# EAGLE design esp32_mpboard (EAGLE 9.5.2)
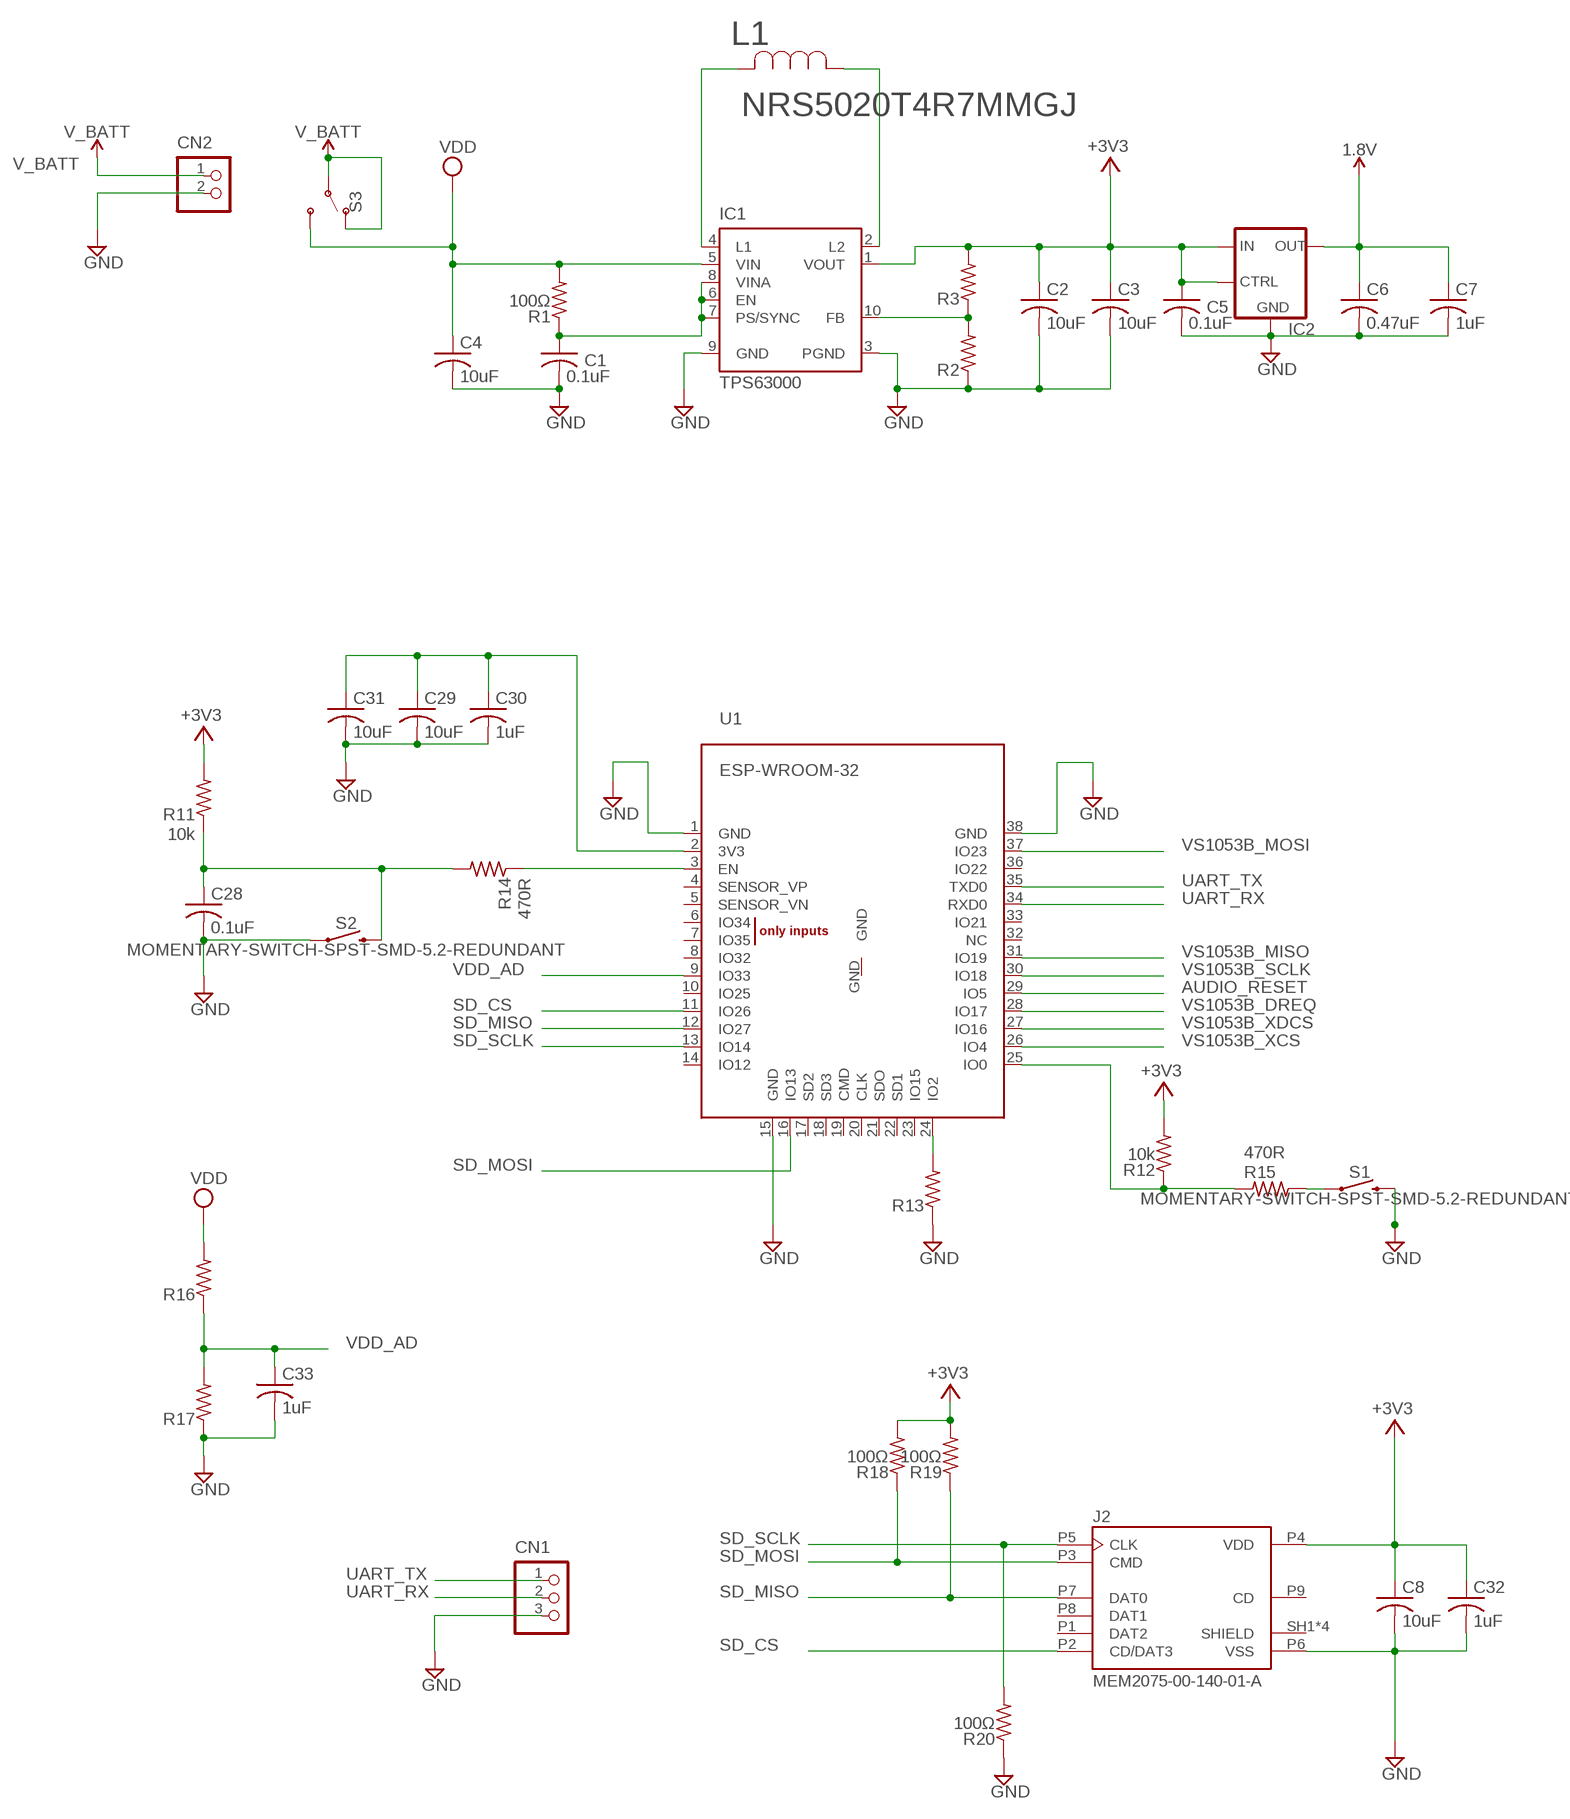
[diagram p0: schematic, sheet 1, part 1 of 2]
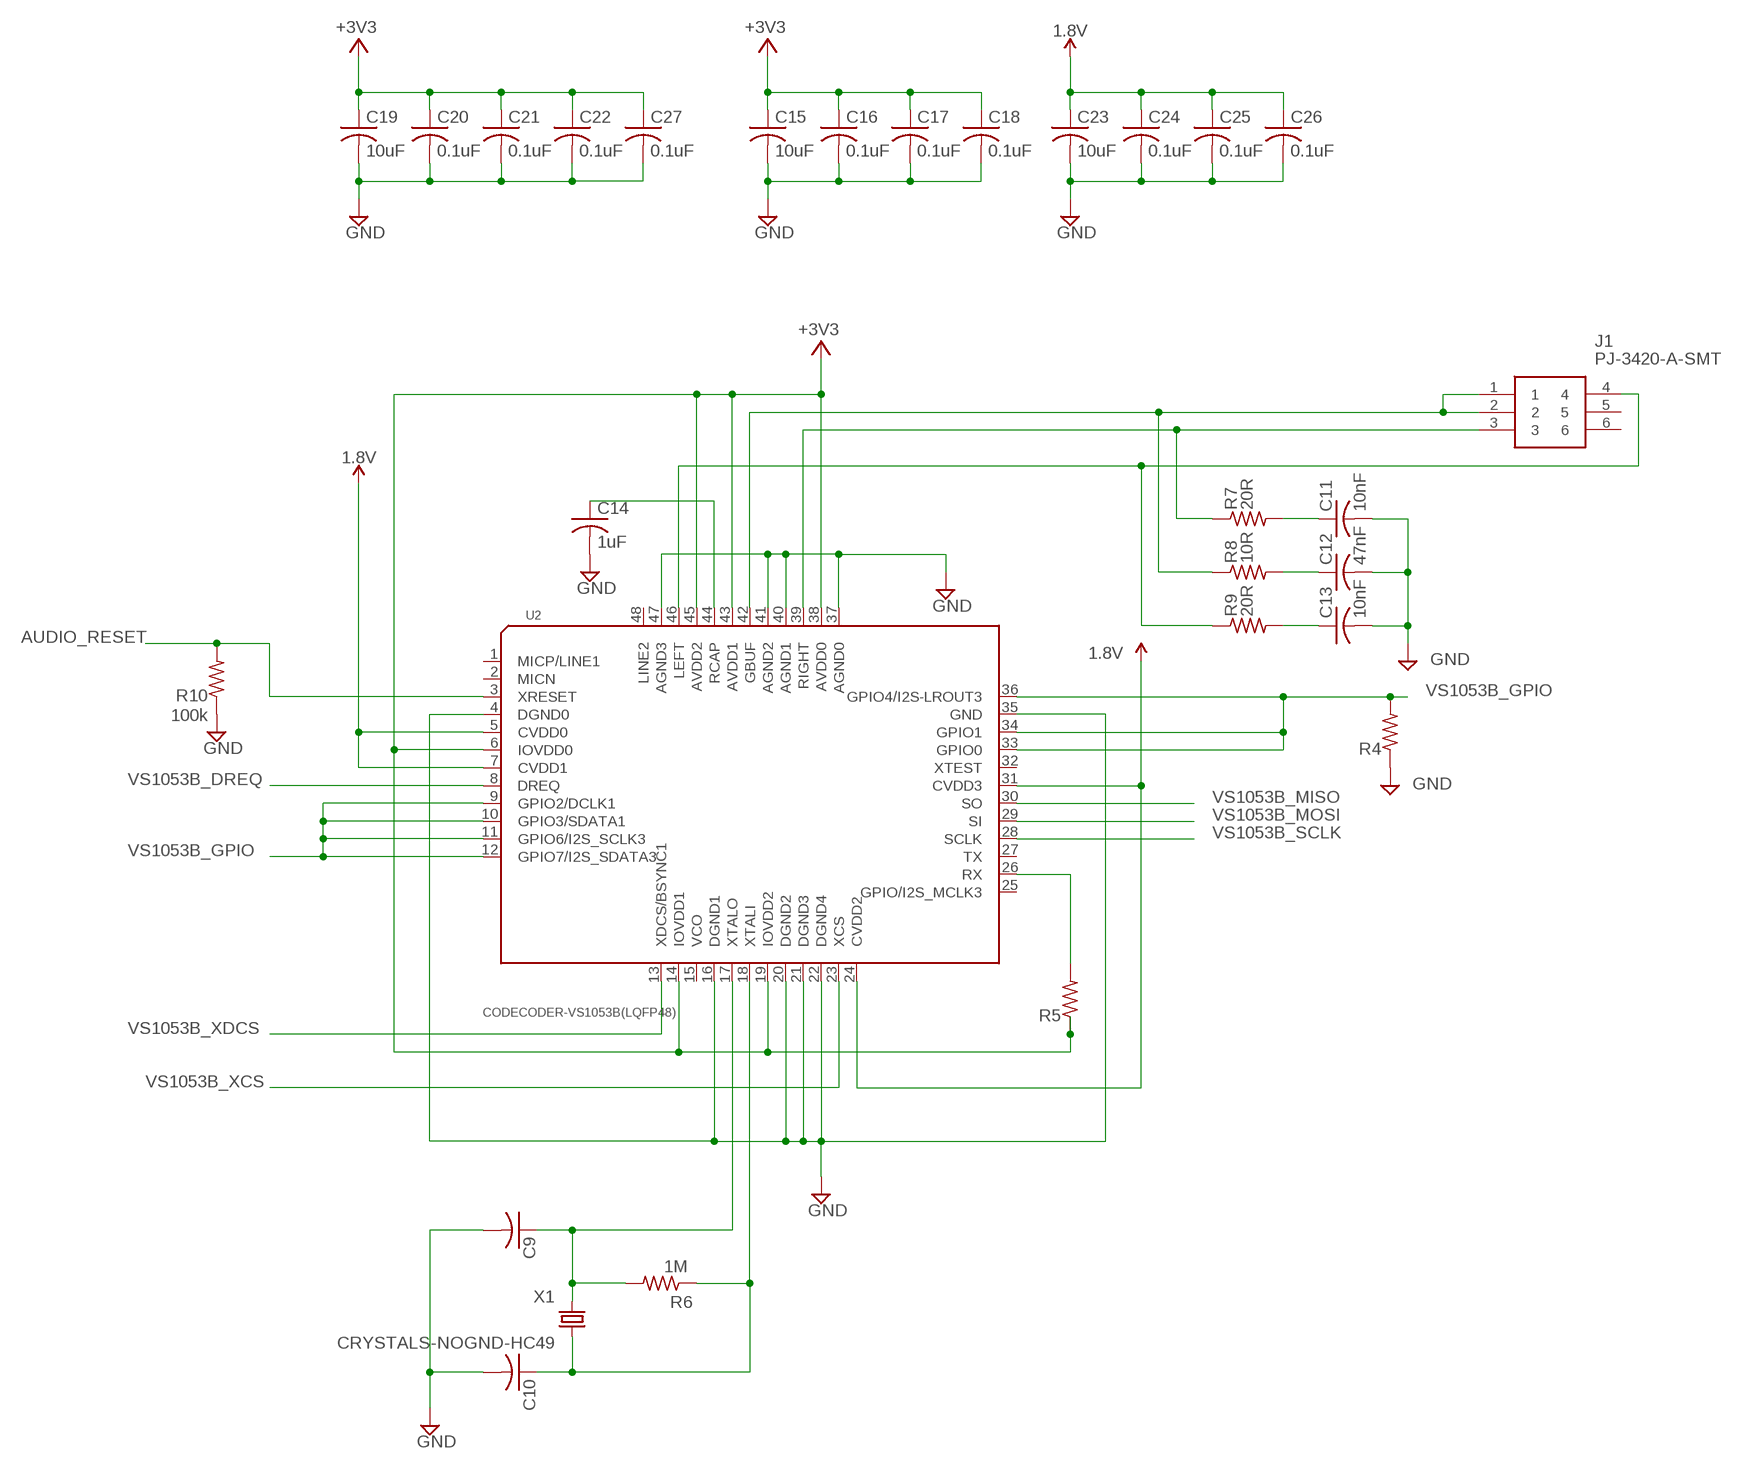
[diagram p1: schematic, sheet 1, part 2 of 2]

## Parts
C1  0.1uF  C-USC0603  [C0603]
C2  10uF  C-USC0805  [C0805]
C3  10uF  C-USC0805  [C0805]
C4  10uF  C-USC0805  [C0805]
C5  0.1uF  C-USC0603  [C0603]
C6  0.47uF  C-USC0603  [C0603]
C7  1uF  C-USC0603  [C0603]
C8  10uF  C-USC0805  [C0805]
C9  C-USC0603  [C0603]
C10  C-USC0603  [C0603]
C11  10nF  C-USC0603  [C0603]
C12  47nF  C-USC0603  [C0603]
C13  10nF  C-USC0603  [C0603]
C14  1uF  C-USC0603  [C0603]
C15  10uF  C-USC0805  [C0805]
C16  0.1uF  C-USC0603  [C0603]
C17  0.1uF  C-USC0603  [C0603]
C18  0.1uF  C-USC0603  [C0603]
C19  10uF  C-USC0805  [C0805]
C20  0.1uF  C-USC0603  [C0603]
C21  0.1uF  C-USC0603  [C0603]
C22  0.1uF  C-USC0603  [C0603]
C23  10uF  C-USC0805  [C0805]
C24  0.1uF  C-USC0603  [C0603]
C25  0.1uF  C-USC0603  [C0603]
C26  0.1uF  C-USC0603  [C0603]
C27  0.1uF  C-USC0603  [C0603]
C28  0.1uF  C-USC0603  [C0603]
C29  10uF  C-USC0805  [C0805]
C30  1uF  C-USC0603  [C0603]
C31  10uF  C-USC0805  [C0805]
C32  1uF  C-USC0603  [C0603]
C33  1uF  C-USC0603  [C0603]
CN1  B3B-XH-A  [B3B-XH-A]
CN2  B2B-XH-A  [B2B-XH-A]
IC1  TPS63000  [DRC-S-PVSON-N10_MANUALSOLDER]
IC2  NJM12888F1812DBV  [SOT23-5]
J1  PJ-3420-A-SMT  [PJ3420ASMT]
J2  MEM2075-00-140-01-A  [GCT_MEM2075-00-140-01-A]
L1  NRS5020T4R7MMGJ  [IND_TAIYO_NRS5020]
R1  100Ω  R-US_R0603  [R0603]
R2  R-US_R0603  [R0603]
R3  R-US_R0603  [R0603]
R4  R-US_R0603  [R0603]
R5  R-US_R0603  [R0603]
R6  1M  R-US_R0603  [R0603]
R7  20R  R-US_R0603  [R0603]
R8  10R  R-US_R0603  [R0603]
R9  20R  R-US_R0603  [R0603]
R10  100k  R-US_R0603  [R0603]
R11  10k  R-US_R0603  [R0603]
R12  10k  R-US_R0603  [R0603]
R13  R-US_R0603  [R0603]
R14  470R  R-US_R0603  [R0603]
R15  470R  R-US_R0603  [R0603]
R16  R-US_R0603  [R0603]
R17  R-US_R0603  [R0603]
R18  100Ω  R-US_R0603  [R0603]
R19  100Ω  R-US_R0603  [R0603]
R20  100Ω  R-US_R0603  [R0603]
S1  MOMENTARY-SWITCH-SPST-SMD-5.2-REDUNDANT  [TACTILE_SWITCH_SMD_5.2MM]
S2  MOMENTARY-SWITCH-SPST-SMD-5.2-REDUNDANT  [TACTILE_SWITCH_SMD_5.2MM]
S3  SWITCH-SPDT-PTH-11.6X4.0MM  [SWITCH_SPDT_PTH_11.6X4.0MM]
U1  ESP-WROOM-32  [ESP-WROOM-32]
U2  CODECODER-VS1053B(LQFP48)  [LQFP48-0.5-7X7MM]
X1  CRYSTALS-NOGND-HC49  [HC49]

## Nets
1.8V: C6.1 C7.1 C23.1 C24.1 C25.1 C26.1 IC2.5(OUT) U2.5(CVDD0) U2.7(CVDD1) U2.24(CVDD2) U2.31(CVDD3)
1.8V1: C9.1 R6.2 U2.17(XTALO) X1.2
3V3: C2.1 C3.1 C5.1 C8.1 C15.1 C16.1 C17.1 C18.1 C19.1 C20.1 C21.1 C22.1 C27.1 C29.1 C30.1 C31.1 C32.1 IC1.1(VOUT) IC2.1(IN) IC2.3(CONTROL) J2.P4(VDD) R3.2 R5.1 R5.2 R12.2 R18.2 R19.2 U1.2(3V3) U2.6(IOVDD0) U2.14(IOVDD1) U2.19(IOVDD2) U2.26(RX) U2.38(AVDD0) U2.43(AVDD1) U2.45(AVDD2) ; supply symbol labelled +3V3
+3V3: R11.2
AUDIO_RESET: R10.2 U1.29(IO5) U2.3(XRESET)
GND: C1.2 C2.2 C3.2 C4.2 C5.2 C6.2 C7.2 C8.2 C9.2 C10.2 C11.2 C12.2 C13.2 C14.2 C15.2 C16.2 C17.2 C18.2 C19.2 C20.2 C21.2 C22.2 C23.2 C24.2 C25.2 C26.2 C27.2 C28.2 C29.2 C30.2 C31.2 C32.2 C33.2 CN1.3 CN2.2 IC1.3(PGND) IC1.9(GND) IC2.2(GND) J2.P6(VSS) R2.1 R4.1 R10.1 R13.1 R17.1 R20.1 S1.3 S1.4 S2.1 S2.2 U1.1(GND) U1.15(GND) U1.38(GND) U2.4(DGND0) U2.16(DGND1) U2.20(DGND2) U2.21(DGND3) U2.22(DGND4) U2.35(GND) U2.37(AGND0) U2.40(AGND1) U2.41(AGND2) U2.47(AGND3)
GND1: C10.1 R6.1 U2.18(XTALI) X1.1
N$1: IC1.4(L1) L1.2
N$2: IC1.2(L2) L1.1
N$3: C1.1 IC1.6(EN) IC1.7(PS/SYNC) IC1.8(VINA) R1.1
N$4: IC1.10(FB) R2.2 R3.1
N$6: J1.4 R9.1 U2.46(LEFT)
N$8: J1.1 J1.2 R8.1 U2.42(GBUF)
N$9: J1.3 R7.1 U2.39(RIGHT)
N$12: C12.1 R8.2
N$13: C13.1 R9.2
N$14: C11.1 R7.2
N$15: R12.1 R15.2 U1.25(IO0)
N$16: C14.1 U2.44(RCAP)
N$17: C28.1 R11.1 R14.2 S2.3 S2.4
N$18: R13.2 U1.24(IO2)
N$20: R14.1 U1.3(EN)
N$21: R15.1 S1.1 S1.2
SD_CS: J2.P2(CD/DAT3) U1.11(IO26)
SD_MISO: J2.P7(DAT0) R19.1 U1.12(IO27)
SD_MOSI: J2.P3(CMD) R18.1 U1.16(IO13)
SD_SCLK: J2.P5(CLK) R20.2 U1.13(IO14)
UART_RX: CN1.2 U1.34(RXD0)
UART_TX: CN1.1 U1.35(TXD0)
V_BATT: CN2.1 S3.1(O) S3.2(P)
VDD: C4.1 IC1.5(VIN) R1.2 R16.2 S3.3(S)
VDD_AD: C33.1 R16.1 R17.2 U1.9(IO33)
VS1053B_DREQ: U1.28(IO17) U2.8(DREQ)
VS1053B_GPIO: R4.2 U2.9(GPIO2/DCLK1) U2.10(GPIO3/SDATA1) U2.11(GPIO6/I2S_SCLK3) U2.12(GPIO7/I2S_SDATA3) U2.33(GPIO0) U2.34(GPIO1) U2.36(GPIO4/I2S-LROUT3)
VS1053B_MISO: U1.31(IO19) U2.30(SO)
VS1053B_MOSI: U1.37(IO23) U2.29(SI)
VS1053B_SCLK: U1.30(IO18) U2.28(SCLK)
VS1053B_XCS: U1.26(IO4) U2.23(XCS)
VS1053B_XDCS: U1.27(IO16) U2.13(XDCS/BSYNC1)
Unconnected: IC1.TH J1.5 J1.6 J2.P1(DAT2) J2.P8(DAT1) J2.P9(CD) U1.4(SENSOR_VP) U1.5(SENSOR_VN) U1.6(IO34) U1.7(IO35) U1.8(IO32) U1.10(IO25) U1.14(IO12) U1.17(SD2) U1.18(SD3) U1.19(CMD) U1.20(CLK) U1.21(SDO) U1.22(SD1) U1.23(IO15) U1.32(NC) U1.33(IO21) U1.36(IO22) U1.GND U2.1(MICP/LINE1) U2.2(MICN) U2.25(GPIO/I2S_MCLK3) U2.27(TX) U2.32(XTEST) U2.48(LINE2)

## Power pins joined to a net without a drawn wire
SHIELD: J2.SH1(SHIELD) J2.SH2(SHIELD) J2.SH3(SHIELD) J2.SH4(SHIELD)
VCO: U2.15(VCO)

## Library data of the parts
C1-C33 = rcl:C-US: CAPACITOR, American symbol; SPICEPREFIX: C
CN1 = jst-xh:B3B-XH-A: Wire-to-Board 2.5mm pitch top mount connector Source: http://www.jst-mfg.com/product/pdf/jpn/XH.pdf http://www.jst-mfg.com/product/detail.php?series=277
CN2 = jst-xh:B2B-XH-A: Wire-to-Board 2.5mm pitch top mount connector Source: http://www.jst-mfg.com/product/pdf/jpn/XH.pdf http://www.jst-mfg.com/product/detail.php?series=277
IC1 = TPS63000:TPS63000: HIGH EFFICIENT SINGLE INDUCTOR BUCK-BOOST CONVERTER WITH 1.8-A SWITCHES Source: http://focus.ti.com/lit/ds/symlink/tps63001.pdf; MPN: TPS63000DRCTG4; OC_FARNELL: 1511852; OC_NEWARK: 59M7217
IC2 = NJM12888F18:NJM12888F18; MF: Texas Instruments; MPN: TPS70912DBVT; OC_FARNELL: unknown; OC_NEWARK: unknown
J1 = PJ-3420-A-SMT:PJ-3420-A-SMT: 3.5 DIP phone jack Source: Datasheet <https://datasheet.lcsc.com/szlcsc/1904121407_XKB-Enterprise-PJ-3420-A-SMT_C319102.pdf>; DESCRIPTION: 3.5 DIP phone jack; HEIGHT: 4.5mm; MANUFACTURER_NAME: XKB; MANUFACTURER_PART_NUMBER: PJ-3420-A-SMT
J2 = MEM2075-00-140-01-A:MEM2075-00-140-01-A: Micro SD Memory Card Connector, 1.4mm Profile SMT, Push-Push, with Normally open Switch; DESCRIPTION: 9 _8 + 1_ Position Card Connector microSD™ Surface Mount, Right Angle Gold; DIGI-KEY_PART_NUMBER: 2073-MEM2075-00-140-01-ACT-ND; DIGI-KEY_PURCHASE_URL: https://www.digikey.jp/product-detail/en/gct/MEM2075-00-140-01-A/2073-MEM2075-00-140-01-ACT-ND/9859685?utm_source=snapeda&utm_medium=aggregator&utm_campaign=symbol; MF: Global Connector Technology; MP: MEM2075-00-140-01-A; PACKAGE: Package Analog Devices
L1 = NRS5020T4R7MMGJ:NRS5020T4R7MMGJ; BUILT_BY: EMA_UL_Team; MANUFACTURER_PART_NUMBER: NRS5020T4R7MMGJ; VENDOR: TAIYO YUDEN
R1-R20 = rcl:R-US_: RESISTOR, American symbol; SPICEPREFIX: R
S1 S2 = SparkFun-Switches:MOMENTARY-SWITCH-SPST: Momentary Switch (Pushbutton) - SPST Normally-open (NO) SPST momentary switches (buttons, pushbuttons). Variants PTH-12MM - 12mm square, through-hole Momentary Pushbutton Switch - 12mm Square <https://www.sparkfun.com/products/9190> (COM-09190) PTH-6.0MM, PTH-6.0MM-KIT - 6.0mm square, through-hole Mini Pushbutton Switch <https://www.sparkfun.com/products/97> (COM-00097) KIT package intended for soldering kit's - only one side of pads' copper is exposed. PTH-RIGHT-ANGLE-KIT - Right-angle, through-hole Right Angle Tactile Button <https://www.sparkfun.com/products/10791> - Used on SparkFun BigTime Watch Kit <https://www.sparkfun.com/products/11734> SMD-12MM - 12mm square, surface-mount Tactile Button - SMD (12mm) <https://www.sparkfun.com/products/12993> (COM-12993) Used on SparkFun PicoBoard <https://www.sparkfun.com/products/11888> SMD-4.5MM - 4.5mm Square Trackball Switch Used on SparkFun Blackberry Trackballer Breakout <https://www.sparkfun.com/products/13169> SMD-4.6MMX2.8MM - 4.60mm x 2.80mm, surface mount Used on SparkFun SAMD21 Mini Breakout <https://www.sparkfun.com/products/13664> SMD-5.2MM, SMD-5.2-REDUNDANT - 5.2mm square, surface-mount Mini Pushbutton Switch - SMD <https://www.sparkfun.com/products/8720> (COM-08720) Used on Arduino Pro Mini <https://www.sparkfun.com/products/11114> REDUNDANT package connects both switch circuits together SMD-6.0X3.5MM - 6.0 x 3.5mm, surface mount Momentary Reset Switch SMD <https://www.sparkfun.com/products/8229> (COM-08229) SMD-6.2MM-TALL - 6.2mm square, surface mount Tactile Button - SMD (6mm) <https://www.sparkfun.com/products/12992> Used on SparkFun Digital Sandbox <https://www.sparkfun.com/products/12651> SMD-RIGHT-ANGLE - Right-angle, surface mount Used on SparkFun Block for Intel® Edison - Arduino <https://www.sparkfun.com/products/13036>; PROD_ID: SWCH-08247; SF_SKU: COM-08720
S3 = SparkFun-Switches:SWITCH-SPDT: Single Pole, Double Throw (SPDT) Switch Single-pole, double-throw (SPDT) switch. Variant Overview SMD-AYZ0202 Surface Mount DPDT Switch <https://www.sparkfun.com/products/597> (COM-00597) Used on e.g. LilyPad Arduino USB - ATmega32U4 Board <https://www.sparkfun.com/products/12049> PTH-11.6X4.0MM SPDT Mini Power Switch <https://www.sparkfun.com/products/102> (COM-00102) Used on e.g. SparkFun Simon Says - Through-Hole Soldering Kit <https://www.sparkfun.com/products/10547> (KIT-10547) PTH-11.6X4.0MM-KIT KIT version of SPDT Mini Power Switch - Simplifies soldering by removing tStop of switch pins - only one side can be soldered. PTH-11.6X4.0MM-LOCK LOCK version of SPDT Mini Power Switch - Offset pins hold switch in place for easier soldering. SMD-RIGHT-ANGLE Surface Mount Right Angle Switch <https://www.sparkfun.com/products/10860> (COM-10860) Used on e.g. SparkFun ESP8266 Thing <https://www.sparkfun.com/products/13231>; PROD_ID: SWCH-08261; SF_SKU: COM-00102
U1 = esp32:ESP-WROOM-32
U2 = CODECODER-VS1053B_LQFP48_:CODECODER-VS1053B(LQFP48): 310080002; AVAILABILITY: Unavailable; DESCRIPTION: VS1053B MP3/WAV/OGG/MIDI Player & Recorder _CODEC_ Chip; MF: VLSI; MP: VS1053B-L; PACKAGE: LQFP-48 VLSI; PRICE: None
X1 = IQD-Frequency-Products:CRYSTALS-NOGND: CRYSTALS CAN NOT GROUNDED

## Board
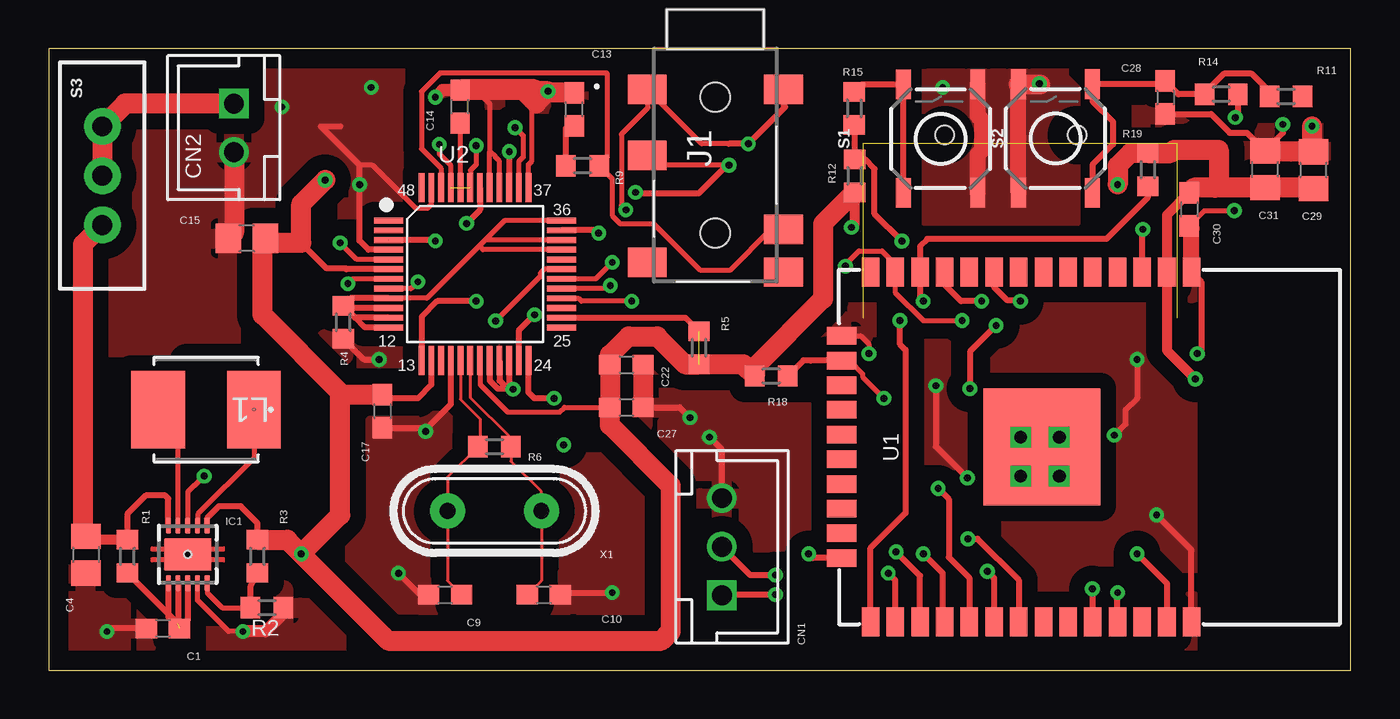
[diagram p2: board, top side]
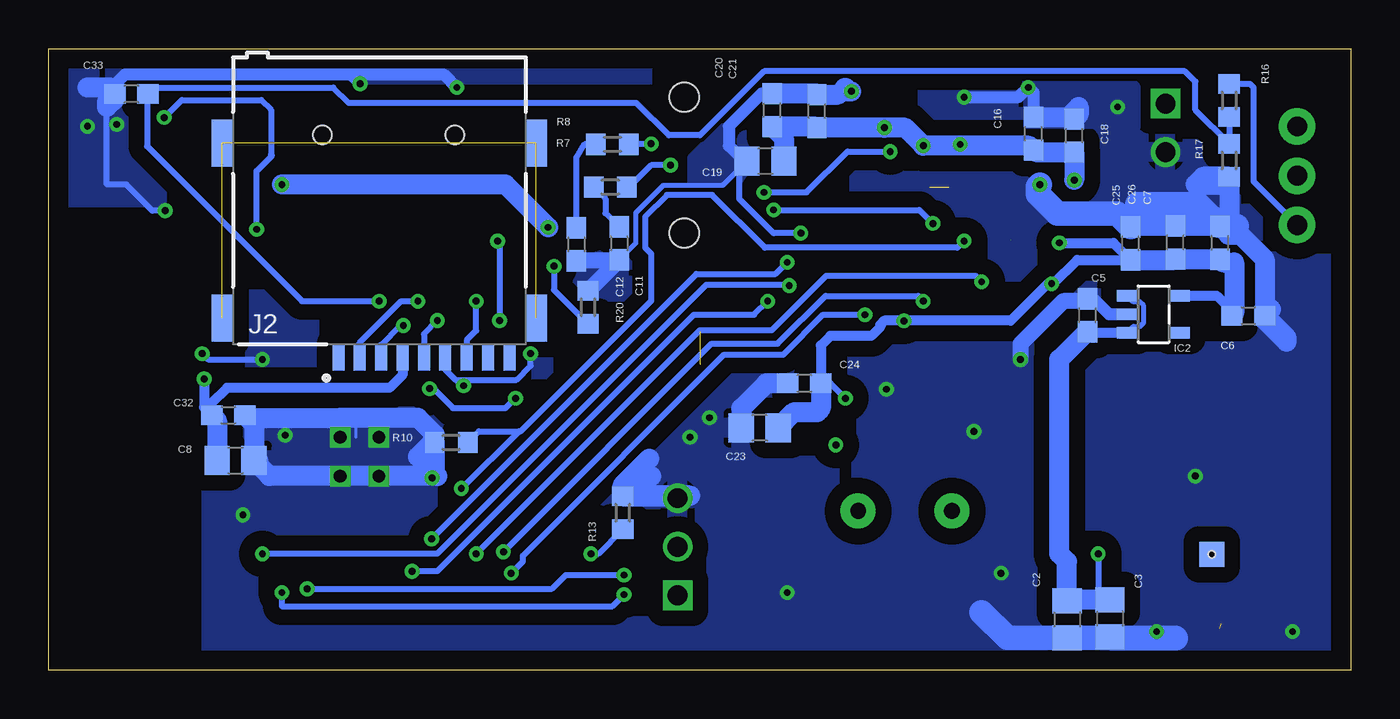
[diagram p3: board, bottom side, seen from below]

Size 67 x 32 mm. Coordinates in mm from the lower left corner, seen from the top.
Outline: 0,0 67,0 67,32 0,32 0,0
Copper layers (1*16): Top 0.035mm / dielectric 1.5mm / Bottom 0.035mm
Design rules "PCBway *": minimum track width 6mil, minimum drill 0.3mm, track to track 0.205mm, track to pad 0.205mm, pad to pad 0.205mm, via to via 0.205mm, smd to smd 8mil, copper to edge 40mil, drill to drill 8mil, minimum pad ring 10mil, minimum via ring 8mil, stop-mask expansion 4mil, vias tented up to drill 0.010159375mm, thermal gap 10mil

### Footprints (pad centres in the part's own frame; a part is rotated, then mirrored left to right if it is on the bottom)
C0603 = smd 1.1 x 1: 1 -0.85,0; 2 0.85,0
C0805 = smd 1.3 x 1.5: 1 -0.95,0; 2 0.95,0
B3B-XH-A = drill 1.016 square: 1 -2.5,0 | drill 1.016: 2 0,0; 3 2.5,0
B2B-XH-A = drill 1.016 square: 1 -1.25,0 | drill 1.016: 2 1.25,0
DRC-S-PVSON-N10_MANUALSOLDER = smd 0.28 x 0.85: 1 -1,-1.475; 2 -0.5,-1.475; 3 0,-1.475; 4 0.5,-1.475; 5 1,-1.475; 6 1,1.475; 7 0.5,1.475; 8 0,1.475; 9 -0.5,1.475; 10 -1,1.475 | smd 1.27 x 1.27 bottom: P$1 0,0 | smd 2.4 x 1.65: TH 0,0 | hole 0.35: 0,0
SOT23-5 = smd 0.6 x 1.05: 1 -0.95,-1.35; 2 0,-1.35; 3 0.95,-1.35; 4 0.95,1.35; 5 -0.95,1.35
PJ3420ASMT = smd 1.5 x 2: 1 -3.9,-3.5; 2 -3.9,3.5; 3 -0.5,-3.5; 4 3.3,3.5; 5 5.5,3.5; 6 5,-3.5 | hole 1.5: -3.5,0; 3.5,0
GCT_MEM2075-00-140-01-A = smd 0.62 x 1.4: P1 2.58,11.42; P2 1.48,11.42; P3 0.38,11.42; P4 -0.72,11.42; P5 -1.82,11.42; P6 -2.92,11.42; P7 -4.02,11.42; P8 -5.12,11.42; P9 -6.22,11.42 | smd 1.1 x 2.4: SH1 -7.6,0.42; SH2 -7.6,9.42; SH3 8.55,9.42; SH4 8.55,0.42 | hole 0.95: -3.4,0; 3.4,0
IND_TAIYO_NRS5020 = smd 2.769 x 3.988: 1 -2.464,0; 2 2.464,0
R0603 = smd 1 x 1.1: 1 -0.85,0; 2 0.85,0
TACTILE_SWITCH_SMD_5.2MM = smd 1.524 x 0.762: 1 -2.794,1.905; 2 2.794,1.905; 3 -2.794,-1.905; 4 2.794,-1.905
SWITCH_SPDT_PTH_11.6X4.0MM = drill 1.016 pad 1.88: 1 0,2.54; 2 0,0; 3 0,-2.54
ESP-WROOM-32 = smd 0.9 x 1.5: 1 7.7,9; 2 6.43,9; 3 5.16,9; 4 3.89,9; 5 2.62,9; 6 1.35,9; 7 0.08,9; 8 -1.19,9; 9 -2.46,9; 10 -3.73,9; 11 -5,9; 12 -6.27,9; 13 -7.54,9; 14 -8.81,9; 25 -8.81,-9; 26 -7.54,-9; 27 -6.27,-9; 28 -5,-9; 29 -3.73,-9; 30 -2.46,-9; 31 -1.19,-9; 32 0.08,-9; 33 1.35,-9; 34 2.62,-9; 35 3.89,-9; 36 5.16,-9; 37 6.43,-9; 38 7.7,-9 | smd 1.5 x 0.9: 15 -10.3,5.715; 16 -10.3,4.445; 17 -10.3,3.175; 18 -10.3,1.905; 19 -10.3,0.635; 20 -10.3,-0.635; 21 -10.3,-1.905; 22 -10.3,-3.175; 23 -10.3,-4.445; 24 -10.3,-5.715 | smd 6 x 6: GND 0,0
LQFP48-0.5-7X7MM = smd 1.5 x 0.3: 1 -4.45,2.75; 2 -4.45,2.25; 3 -4.45,1.75; 4 -4.45,1.25; 5 -4.45,0.75; 6 -4.45,0.25; 7 -4.45,-0.25; 8 -4.45,-0.75; 9 -4.45,-1.25; 10 -4.45,-1.75; 11 -4.45,-2.25; 12 -4.45,-2.75; 25 4.45,-2.75; 26 4.45,-2.25; 27 4.45,-1.75; 28 4.45,-1.25; 29 4.45,-0.75; 30 4.45,-0.25; 31 4.45,0.25; 32 4.45,0.75; 33 4.45,1.25; 34 4.45,1.75; 35 4.45,2.25; 36 4.45,2.75 | smd 0.3 x 1.5: 13 -2.75,-4.45; 14 -2.25,-4.45; 15 -1.75,-4.45; 16 -1.25,-4.45; 17 -0.75,-4.45; 18 -0.25,-4.45; 19 0.25,-4.45; 20 0.75,-4.45; 21 1.25,-4.45; 22 1.75,-4.45; 23 2.25,-4.45; 24 2.75,-4.45; 37 2.75,4.45; 38 2.25,4.45; 39 1.75,4.45; 40 1.25,4.45; 41 0.75,4.45; 42 0.25,4.45; 43 -0.25,4.45; 44 -0.75,4.45; 45 -1.25,4.45; 46 -1.75,4.45; 47 -2.25,4.45; 48 -2.75,4.45
HC49 = drill 0.813 pad 1.8: 1 -2.413,0; 2 2.413,0

### Placement (x,y rotation side)
C1  5.89,2.16 180 top
C2  14.6,2.63 270 bottom
C3  12.4,2.68 270 bottom
C4  1.92,5.95 270 top
C5  13.55,18.28 90 bottom
C6  5.28,18.25 0 bottom
C7  6.73,22.01 90 bottom
C8  57.38,10.8 0 bottom
C9  20.4,3.89 180 top
C10  25.48,3.89 0 top
C11  37.65,21.97 270 bottom
C12  39.85,21.92 270 bottom
C13  27.05,28.87 90 top
C14  21.17,29.01 90 top
C15  10.2,22.23 180 top
C16  16.33,27.62 90 bottom
C17  17.17,13.33 270 top
C18  14.23,27.52 90 bottom
C19  30.12,26.2 180 bottom
C20  29.77,28.83 90 bottom
C21  27.47,28.78 90 bottom
C22  29.73,15.73 0 top
C23  30.41,12.48 180 bottom
C24  28.12,14.77 180 bottom
C25  11.33,21.97 90 bottom
C26  9.03,22.02 90 bottom
C27  29.73,13.53 0 top
C28  57.45,29.48 270 top
C29  65.08,25.74 90 top
C30  58.67,23.73 270 top
C31  62.58,25.79 90 top
C32  57.75,13.13 0 bottom
C33  62.73,29.67 180 bottom
CN1  34.64,6.36 90 top
CN2  9.54,27.92 270 top
IC1  7.16,5.97 180 top
IC2  10.16,18.33 270 bottom
J1  34.3,26 270 top
J2  49.51,27.55 180 bottom
L1  8.1,13.42 180 top
R1  4.05,5.87 90 top
R2  11.24,3.23 180 top
R3  10.74,5.87 90 top
R4  15.16,17.91 90 top
R5  33.46,16.6 90 top
R6  22.94,11.51 180 top
R7  38.11,24.87 180 bottom
R8  37.99,27.07 180 bottom
R9  27.47,25.97 180 top
R10  46.29,11.73 0 bottom
R11  63.67,29.53 0 top
R12  41.47,25.45 270 top
R13  37.46,8.11 270 bottom
R14  60.33,29.65 180 top
R15  41.45,28.92 270 top
R16  6.26,29.33 90 bottom
R17  6.26,26.25 90 bottom
R18  37.18,15.15 180 top
R19  56.55,25.77 90 top
R20  39.25,18.68 270 bottom
S1  45.89,27.36 90 top
S2  51.8,27.37 90 top
S3  2.76,25.46 0 top
U1  51.1,11.5 0 top
U2  21.94,20.4 0 top
X1  22.94,8.2 180 top

### Tracks (layer width: path | path; a pad name or v marks a point on that pad's centre or on a via)
1.8V  (via drill 0.35)
  Top 0.254: v23,17.98 25.31,20.29 25.31,20.44 25.52,20.65 U2.31 | U2.5 15.85,21.15 v15,22 | U2.7 15.65,20.15 v15.4,19.9
  Top 0.305: v26,14 25,14 24.69,14.31 U2.24
  Bottom 0.305: C24.1 26.77,14.77 v26,14 | v23,18 v23,17.98
  Bottom 0.508: IC2.5 6.9,19.28 6,18.38 | v15,22 12.21,22 C25.1 14.08,21.12 15.3,19.9 v15.4,19.9 15.6,19.9 17.5,18 v23,18 24,18 24.21,17.79 24.21,17.68 24.68,17.21 26.79,17.21 27.27,16.73 C24.1
  Bottom 1.016: C25.1 9.08,21.12 C26.1 C7.1 6.57,21 6,21 6,18.38 C6.1 | C24.1 27.27,13.49 27.46,13.3 28.64,13.3 C23.1
1.8V1
  Top 0.152: U2.17 21.19,13.95 22.19,12.95 22.19,11.61 R6.2 20.53,9.95 X1.2 20.53,4.61 C9.1
3V3  (via drill 0.35)  (2 unrouted)
  Top 0.254: U2.43 21.71,24.87 21.71,25.73 22,26.03 v22,27 | v20.1,27.07 20.1,26.58 20.67,26.01 20.67,24.87 U2.45 | U2.38 24.19,26.19 24.41,26.41 24.41,27.52 v24,27.93 | U2.19 22.21,15.93 22.21,14.71 23.62,13.29 26.29,13.29 26.53,13.53 C27.1
  Top 0.305: U2.14 19.69,14.69 19,14 17.35,14 C17.1 | C27.1 28.67,13.32 | IC1.1 8.16,7.84 8.76,8.45 9.88,8.45 10.74,7.59 R3.2 | U2.6 15.32,20.65 15.28,20.68 14.32,20.68 13,22 | U2.26 32.76,18.15 R5.2
  Top 0.508: R12.2 41.47,22.97 v41.3,22.8 | C30.1 57.53,23.44 U1.2 57.53,16.47 v59,15
  Top 1.016: v13,6 15,8 15,14.18 | 15,14.18 15,14.3 11,18.3 11,22 11.38,22 | v14.23,25.23 13,24 13,22 11.38,22 | 11.38,22 C15.1 | v13,6 17.48,1.52 31.52,1.52 32,2 32,9.5 28.88,12.62 C27.1 C22.1 28.88,16.23 29.84,17.19 31.3,17.19 32.74,15.75 R5.1 35.73,15.75 R18.2 36.33,15.61 39.85,19.13 39.85,22.98 R12.2 | C29.1 65.03,24.84 C31.1 60,24.84 | 60,24.84 58.93,24.84 C30.1 | v55,25 55,25.97 55.65,26.62 R19.2 57.73,26.62 57.9,26.79 60.2,26.79 60.2,25.04 60,24.84 | C17.1 15,14.18 | R3.2 12.28,6.72 v13,6
  Bottom 0.254: IC2.3 11.19,17.7 10.85,17.7 10.65,17.89 10.65,18.77 10.85,18.96 11.19,18.96 IC2.1
  Bottom 0.305: v13,6 13,4.23 C3.1
  Bottom 0.508: C5.1 13.5,17.38 IC2.3 | J2.P4 48.79,15.21 49.46,14.54 57.82,14.54 58.6,13.76 C32.1 59,13.53 v59,15
  Bottom 1.016: C3.1 14.55,3.63 C2.1 14.6,5.6 15,6 15,16 13.57,17.43 C5.1 | v14.23,25.23 C18.1 16.23,26.67 C16.1 16.56,27 v22,27 22.93,27.93 v24,27.93 C21.1 27.52,27.98 C20.1 29.17,27.38 C19.1 | v41.3,22.8 43.5,25 v55,25 | C32.1 58.33,12.86 C8.1
AUDIO_RESET  (via drill 0.35)  (1 unrouted)
  Top 0.305: v19.9,22.1 v19.91,22.1 19.85,22.15 U2.3 | U1.29 47.37,4.76 46.32,5.82 46.32,8.82 v45.77,9.37
  Bottom 0.305: v19.9,22.1 20.24,21.76 30.16,21.76 32.87,24.47 35.19,24.47 36.31,23.34 36.31,21.75 36,21.45 36,19.02 42.71,12.31 42.81,12.31 | v45.77,9.37 45.75,9.37 42.81,12.31 | R10.2 44.86,12.31 42.81,12.31
GND  (via drill 0.35, 0.65 pad 1, 0.65 pad 1.05)
  Top 0.254: v8,10 7.49,9.49 7.46,9.49 7.16,9.2 IC1.3 | U2.41 22.69,26.69 22.71,26.71 | 22.71,26.71 22.71,29.15 22,29.86 | U2.40 23.19,26.21 22.99,26.41 22.99,26.43 22.71,26.71 | U2.37 24.69,26.04 24.87,26.22 24.87,28.97 25.09,29.18 | U2.47 19.67,24.83 19.67,23.96 19.48,23.77 18.9,23.77 16.67,26 16,26 | v10,2 9.26,2 7.66,3.6 IC1.9 | U1.15 41.78,17.21 42.2,16.8 v42.2,16.3 | C30.2 59.45,23.66 v61,23.66
  Top 0.305: C28.2 59.81,28.63 60.77,27.67 61.65,27.67 C31.2 63.5,27.66 v63.5,28.1 | C1.2 3.16,2.16 v3,2 | C10.2 26.44,4 v29,4 | U1.38 58.8,6.2 v57,8 | CN1.3 34.64,11.36 v34,12 | C27.2 32.47,13.53 v33,13 | v45.65,14.65 45.65,11.52 v47.27,9.9 | 24.85,28.95 25.09,29.18 | U2.4 16.46,21.65 16,22.11 v16,25 16,26 14,28 15,28 | R4.1 16.22,16 v17,16 | C9.2 19.11,3.89 v18,5 | C17.2 19.22,12.48 v19.4,12.3 19.4,12.4 20.69,13.69 U2.16 | v28.3,22.5 28.15,22.65 U2.35 | U2.21 23.19,14.91 23.5,14.6 23.93,14.6 | 23.93,14.6 24.03,14.6 v23.9,14.47 23.69,14.68 U2.22 | U2.20 22.69,14.91 23.1,14.5 23.83,14.5 23.93,14.6 | C30.2 58.88,22.88 | U1.1 59.3,20 59.3,16.3 v59.1,16.3 | v56,16 56,14 55.41,13.4 55.41,12.67 v54.83,12.1 | 41.46,17.21 U1.15
  Top 0.61: R2.1 12.09,2.93 11.16,2 v10,2 | C14.2 20.26,29.86 v19.9,29.5
  Top 0.813: S1.4 47.8,28.55 48.01,28.34 48.01,26.76 47.8,26.55 S1.3 | S2.1 S2.2 | U1.1 58.8,22.75 C30.2
  Top 1.016: 23,29.86 24.41,29.86 25.09,29.18 v25.7,29.8 25.1,29.8 | 23,29.86 22,29.86 C14.2 21.21,29.9 23.04,29.9 | CN2.2 9.54,22.52 C15.2 | C31.2 62.63,26.69 C29.2 65,26.77 v65,28 | C22.2 C27.2 | S2.2 51,30.16 | 23.04,29.9 25,29.9 25.1,29.8 | 23.04,29.9 23,29.86 | C13.2 25.18,29.72 25.1,29.8
  Bottom 0.152: 51.19,12 51.19,12.64 51.36,12.81 51.81,12.81 52,13
  Bottom 0.254: C19.2 32.32,24.95 35.38,24.95 36.79,23.55 36.79,21.98 C11.2
  Bottom 0.305: J2.P6 46.59,15.49 46.05,14.95 | 46.05,14.95 45.7,14.6 v45.65,14.65 | 16.33,29 C16.2 | v28.3,22.5 29.7,22.5 31.47,24.27 31.47,25.8 C19.2 | v61,23.66 61.66,23.66 63,25 64,25 64,29.25 | v59.1,16.3 58.8,16 v56,16 | v42.2,16.3 42.2,15.68 42.93,14.95 46.05,14.95 | v47.27,9.9 47.27,11.6 R10.1
  Bottom 0.61: C5.2 13.25,19.13 12.45,18.33 IC2.2 | C33.2 63.58,30.17 63.07,30.68 51.46,30.68 | 51.46,30.68 v50.97,30.19 | 51.46,30.68 46.68,30.68 v46,30 | v19.9,29.5 17.1,29.5 v16.6,30 16.33,29.73 16.33,29 | C19.2 31.2,26.2 32,27 32,28 30.32,29.68 C20.2
  Bottom 0.813: C5.2 13.68,19 14.8,19 17,16.8 v17,16 | C12.2 39.8,21.12 C11.2 R20.1
  Bottom 1.016: R17.1 7.6,25.4 8,25 6.66,25 R17.1 | R17.1 6.26,23.33 C7.2 | C16.2 14.53,28.47 14,29 14,28.6 C18.2 | C7.2 11.29,22.86 C25.2 | 27.52,29.68 C21.2 26.37,29.63 26.03,29.97 | 27.52,29.68 C20.2 | C8.2 56.43,12.66 C32.2 56.77,13 52,13 48,13 47.14,12.14 R10.1 | R10.1 47.27,11.73 48,11 47.87,11 R10.1 | R10.1 47.14,10.14 47,10 v52,10 55.63,10 C8.2 | C8.2 56.2,10.8 | C33.2 63.58,29.42 64,29 64,29.25 C33.2 | C33.2 63.91,30 | 63.91,30 65,30 | 63.91,30 63.85,30 | R13.1 34.04,8.96 34,9 37.42,9 R13.1 | R13.1 36.42,10 36,10 | R13.1 37.46,9.54 36.1,10.9 | 4.1,18.58 C6.2 | C6.2 4.43,18.03 3.3,16.9 3.3,17.12 C6.2 | 27.5,29.7 27.52,29.68 | C7.2 6.29,22.42 5.7,22.42 4.43,21.16 C6.2 | C24.2 30.07,14.77 31.36,13.48 C23.2 | 26,29.97 26.03,29.97 | 26.03,29.97 25.87,29.8 v25.7,29.8
  Bottom 1.27: C3.2 12.32,1.65 9,1.65 9.03,1.68 C2.2 17.68,1.68 19,3 | 5.86,22.86 C7.2 7.87,24 11,24 | C25.2 12.01,23.5 15.1,23.5 16.1,24.5 16.1,24.9 v16,25
  other vias: 50,12 12,29 52,12 50,10
  pour Top (isolate 0.813): -2,34 -2,-1 -1,-2 70,-2 71,-1 71,33 70,34
  pour Bottom (isolate 0.813): -2,33 -2,-1 -1,-2 74,-2 71,1 71,34 -1,34
  pour Bottom (isolate 0.813): 6,23 13,23 12,24 7,24
  pour Bottom: 7,24 6,24 7,23 12,23 13,24
  pour Top (no thermals): 45,31 45,23 53,23 53,30 52,31
  pour Top (no thermals): 19,13 16.5,13 16.4,12.9 16.4,11.1 18.4,11.1 18.9,11.6 18.9,12.9
  pour Top (no thermals): 18,5 18,3 19.6,3 19.6,4.7 19.4,4.9 19.3,5
  pour Top (no thermals): 28,3 26.3,3 26.3,5.1 27.8,5.1 27.9,5 27.9,3.1
  pour Bottom (no thermals): 31,26 32.3,27.3 32.3,28.1 34,26.4 34,25 32.4,25 31.4,26
  pour Bottom (no thermals): 11,30 11,28 11,27.9 11.1,28 16.7,28 16.7,30.1 16.8,30.2 11.6,30.2 11.1,30.2 11,30.1
  pour Bottom: 48,13 48,8 54,8 54,12 53,13
GND1
  Top 0.152: U2.18 21.69,14.05 23.79,11.95 R6.1 23.79,10.76 25.35,9.2 X1.1 25.35,4.61 C10.1
N$1
  Top 0.254: IC1.4 6.66,12.4
  Top 0.305: 6.66,12.4 L1.2
N$2
  Top 0.254: IC1.2 7.68,7.46 7.68,8.05 10.56,10.93 L1.1
N$3  (1 unrouted)
  Top 0.305: R1.1 6.67,2.4 | IC1.7 6.66,2.24 | 6.66,2.24 C1.1 7.16,2.58 IC1.8 | IC1.6 6.16,2.74 6.66,2.24
N$4
  Top 0.254: IC1.10 8.16,4 8.93,3.23 R2.2
  Top 0.305: R3.1 10.39,4.32 R2.2
N$5  (via drill 0.35)
  other vias: 26.5,11.6
N$6
  Top 0.254: U2.46 20.19,25.85 19.19,26.85 19.19,29.79 20.14,30.74 28.72,30.74 28.72,26.37 R9.1 28.99,25.3 28.99,23.41 29.41,22.99 31.13,22.99 33.52,20.61 35.08,20.61 37.18,22.7 J1.4
N$8  (via drill 0.35)
  Top 0.254: 35,27.1 33.6,27.1 30.85,29.85 | 30.85,29.85 J1.1 | 30.85,29.85 30.85,28.97 29.47,27.59 29.47,23.93 v29.7,23.7 | J1.2 37.8,29.08 37.89,28.99 37.89,29.81 J1.2
  Top 0.305: v36,27.1 35,27.1 | U2.42 22.19,23.69 v21.5,23 | 37.89,28.99 v36,27.1 | v36,27.1 36.1,27
  Bottom 0.305: R8.1 37.07,27 37,27 37.1,27.1 v36,27.1 | v21.5,23 22.2,23.7 v29.7,23.7
N$9  (via drill 0.35)
  Top 0.254: v35,26 31.3,26 J1.3
  Top 0.305: v35,26 34.9,26 33.44,24.54 30.26,24.54 v30.2,24.6 | v23.7,26.7 U2.39
  Bottom 0.305: R7.1 37.13,24.87 36,26 v35,26 | v30.2,24.6 28,24.6 25.9,26.7 v23.7,26.7
N$12
  Bottom 0.305: C12.1 39.85,26.39 39.42,27.07 R8.2
N$13
  Top 0.305: C13.1 26.62,27.89 R9.2
N$14
  Bottom 0.305: R7.2 38.36,24.27 38.36,23.53 C11.1
N$15  (via drill 0.35)
  Top 0.305: U1.25 42.29,6.3 44.09,8.1 44.09,16.49 43.8,16.78 v43.8,18 | R15.2 41.45,26.32 R12.1 42,26.3 42.5,25.8 42.5,23.49 v43.9,22.09
  Bottom 0.305: v43.9,22.09 43.8,21.99 v43.8,18
N$16
  Top 0.254: C14.1 21.17,25.74 21.17,24.87 U2.44
  Top 0.305: C14.1 21.17,28.54
N$17
  Top 0.305: R11.1 62.82,29.79 61.91,30.7 60.45,30.7 59.48,29.73 R14.2 58.13,29.65 C28.1 57.28,30.16 S2.4 53.7,29.28 54.75,28.23 54.75,27.07 53.7,26.02 S2.3
N$18  (via drill 0.35)
  Top 0.305: U1.24 39.31,5.79 v39.1,6
  Bottom 0.305: v39.1,6 38.72,6 R13.2
N$20  (via drill 0.35)
  Top 0.305: U1.3 56.26,22.7 v56.3,22.7 | R14.1 61.18,28.58 v61.05,28.45
  Bottom 0.305: v56.3,22.7 56.3,25.7 55.5,26.5 55.55,26.55 55.55,28.85 56.05,29.35 60.15,29.35 v61.05,28.45
N$21
  Top 0.305: S1.1 S1.2 | S1.2 41.83,30.15 | 41.83,30.15 R15.1 41.83,30.15 | S1.2 41.83,30.15
SD_CS  (via drill 0.35)
  Top 0.305: U1.11 46.1,19.84 46.94,19 v48,19
  Bottom 0.305: J2.P2 50.99,16.87 48.86,19 v48,19
SD_MISO  (via drill 0.35)
  Top 0.305: R19.1 56.55,24.32 54.43,22.2 45.2,22.2 44.83,21.83 U1.12 44.83,19.17 v45,19
  Bottom 0.305: J2.P7 45.49,17 45,17.49 v45,19
SD_MOSI  (via drill 0.35)
  Top 0.254: v42.98,14 41.88,15.1 41.88,15.26 41.2,15.95 U1.16
  Top 0.305: R18.1 38.83,15.95 39.2,15.95 39.21,15.95 U1.16 40.7,16.05 | v48.75,17.75 47.4,16.4 v47.4,14.5
  Bottom 0.305: J2.P3 49.91,16.14 49.91,16.76 48.91,17.75 v48.75,17.75 | v47.4,14.5 47.2,14.5 46.2,13.5 43.5,13.5 42.98,14.02 v42.98,14
SD_SCLK  (via drill 0.35)
  Top 0.254: v41,20.8 41,20.88 41.7,21.58 42.88,21.58 43.57,20.89 43.57,20.51 U1.13 43.55,20.49 43.55,19.45 45,18 v47,18
  Bottom 0.305: v41,20.8 41,19.58 R20.2 | v47,18 47.69,17.31 J2.P5
SHIELD  (3 unrouted)
UART_RX  (via drill 0.35)
  Top 0.305: U1.34 53.72,4.18 v53.7,4.2 | v37.4,4.9 36.1,4.9 CN1.2
  Bottom 0.305: v53.7,4.2 41.1,4.2 40.4,4.9 v37.4,4.9
UART_TX  (via drill 0.35)
  Top 0.305: U1.35 v54.99,3.99 v55,4 | v37.4,3.9 34.68,3.9 CN1.1
  Bottom 0.305: v55,4 55,3.3 38,3.3 v37.4,3.9
V_BATT
  Top 1.016: CN2.1 3.93,29.17 S3.1 S3.2
VDD
  Top 0.305: IC1.5 6.16,8.84 6,9 5,9 4.05,8.05 R1.2
  Top 0.508: R1.2 2.1,6.72 C4.1
  Top 1.016: C4.1 1.76,7.06 1.76,21.92 S3.3
  Bottom 0.305: S3.3 5,25.16 5,30 5.18,30.18 R16.2
VDD_AD  (via drill 0.35)
  Top 0.305: v50,19 49.95,19.05 49.33,19.05 48.64,19.74 U1.9
  Bottom 0.305: R16.1 R17.2 8,28.84 8,30.3 8.53,30.83 30.2,30.83 33.49,27.53 35.09,27.53 36.75,29.2 51.55,29.2 52.35,30 61.55,30 C33.1 61.94,29.61 61.94,26.97 53.97,19 v50,19
VS1053B_DREQ  (via drill 0.35)
  Top 0.254: v19,20 18.65,19.65 U2.8
  Top 0.305: U1.28 46,2.6 46,5 v45,6
  Bottom 0.305: v45,6 33.49,17.51 29.79,17.51 26.99,20.31 19.31,20.31 v19,20
VS1053B_GPIO
  Top 0.254: U2.36 26.37,23.13 23.45,23.13 22.46,22.15 | U2.9 19.46,19.15 22.16,21.84 | U2.34 22.46,22.15 | 22.46,22.15 22.16,21.84 | U2.33 22.35,21.65 22.16,21.84
  Top 0.305: U2.9 15.55,19.15 R4.2 15.27,18.65 | U2.10 15.27,18.65 | U2.11 15.77,18.15 | 15.77,18.15 15.27,18.65 | U2.12 16.27,17.65 15.77,18.15
VS1053B_MISO  (via drill 0.35)
  Top 0.254: v29,21 28.71,20.71 28.15,20.15 U2.30
  Top 0.305: v47.3,6.77 47.8,6.77 49.91,4.66 U1.31
  Bottom 0.305: v29,21 29.6,20.4 33.67,20.4 v47.3,6.77
VS1053B_MOSI  (via drill 0.35)
  Top 0.254: v28.9,19.8 28.75,19.65 U2.29
  Top 0.305: v56,6 57.53,4.47 U1.37
  Bottom 0.305: v28.9,19.8 28.94,19.84 33.16,19.84 47,6 v56,6
VS1053B_SCLK  (via drill 0.35)
  Top 0.254: v30,19 27.41,19 27.28,19.13 26.41,19.13 U2.28
  Top 0.305: v48.3,5.1 48.64,4.76 U1.30
  Bottom 0.305: v30,19 30.7,18.3 33.8,18.3 47,5.1 v48.3,5.1
VS1053B_XCS  (via drill 0.35)
  Top 0.305: U1.26 43.56,4.64 v43.2,5 | v25,18.3 24.19,17.49 U2.23
  Bottom 0.305: v25,18.3 27.15,18.3 29.2,16.25 32.25,16.25 42.6,5.9 42.6,5.6 42.8,5.4 v43.2,5 | v43.2,5
VS1053B_XDCS  (via drill 0.35)
  Top 0.305: U1.27 44.83,4.87 v43.6,6.1 | v22,19 20,19 19.19,18.19 U2.13
  Bottom 0.305: v22,19 22.27,19.27 27.03,19.27 29.49,16.81 32.89,16.81 v43.6,6.1